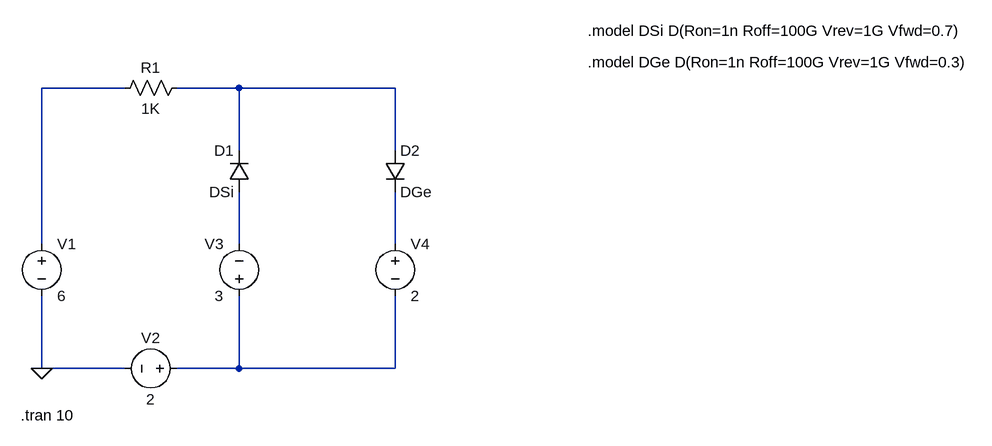
[diagram p0: schematic Draft1.asc]
Draft1.asc, the LTspice schematic file:
Version 4
SHEET 1 1512 680
WIRE 160 -96 32 -96
WIRE 336 -96 240 -96
WIRE 576 -96 336 -96
WIRE 336 0 336 -96
WIRE 576 0 576 -96
WIRE 32 144 32 -96
WIRE 336 144 336 64
WIRE 576 144 576 64
WIRE 32 336 32 224
WIRE 160 336 32 336
WIRE 336 336 336 224
WIRE 336 336 240 336
WIRE 576 336 576 224
WIRE 576 336 336 336
FLAG 32 336 0
SYMBOL voltage 32 128 R0
WINDOW 123 0 0 Left 0
WINDOW 39 0 0 Left 0
SYMATTR InstName V1
SYMATTR Value 6
SYMBOL voltage 256 336 R90
WINDOW 0 -32 56 VBottom 2
WINDOW 3 32 56 VTop 2
SYMATTR InstName V2
SYMATTR Value 2
SYMBOL voltage 336 240 R180
WINDOW 0 24 96 Left 2
WINDOW 3 24 16 Left 2
SYMATTR InstName V3
SYMATTR Value 3
SYMBOL diode 352 64 R180
WINDOW 0 24 64 Left 2
WINDOW 3 24 0 Left 2
SYMATTR InstName D1
SYMATTR Value DSi
SYMBOL diode 560 0 R0
SYMATTR InstName D2
SYMATTR Value DGe
SYMBOL res 144 -80 R270
WINDOW 0 32 56 VTop 2
WINDOW 3 0 56 VBottom 2
SYMATTR InstName R1
SYMATTR Value 1K
SYMBOL voltage 576 128 R0
SYMATTR InstName V4
SYMATTR Value 2
TEXT 872 -184 Left 2 !.model DSi D(Ron=1n Roff=100G Vrev=1G Vfwd=0.7)
TEXT 872 -136 Left 2 !.model DGe D(Ron=1n Roff=100G Vrev=1G Vfwd=0.3)
TEXT 0 408 Left 2 !.tran 10

The netlist it stands for:
* Draft1.asc
V1 N001 0 6
V2 N005 0 2
V3 N005 N003 3
D1 N003 N002 DSi
D2 N002 N004 DGe
R1 N001 N002 1K
V4 N004 N005 2
.model D D
.lib standard.dio
.model DSi D(Ron=1n Roff=100G Vrev=1G Vfwd=0.7)
.model DGe D(Ron=1n Roff=100G Vrev=1G Vfwd=0.3)
.tran 10
.backanno
.end